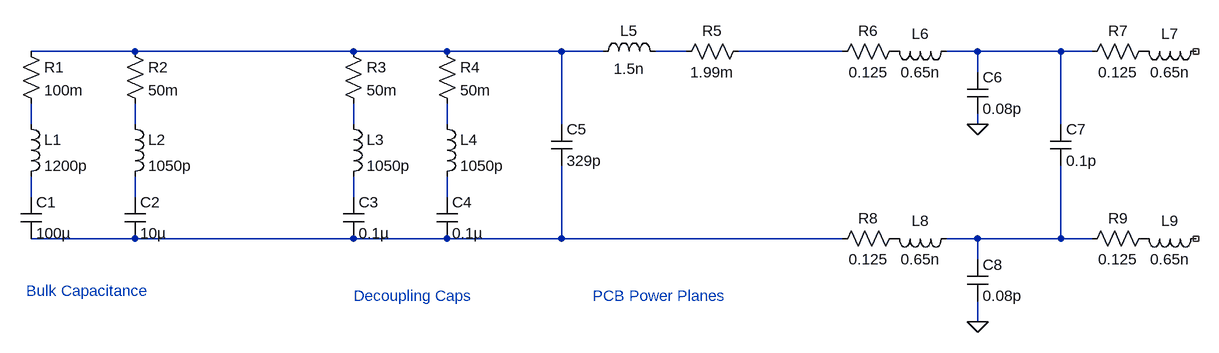
[diagram p0: schematic Draft3.asc]
Draft3.asc, the LTspice schematic file:
Version 4.1
SHEET 1 1864 680
WIRE 224 16 64 16
WIRE 560 16 224 16
WIRE 704 16 560 16
WIRE 880 16 704 16
WIRE 944 16 880 16
WIRE 1072 16 1024 16
WIRE 1312 16 1152 16
WIRE 1520 16 1472 16
WIRE 1648 16 1520 16
WIRE 1696 16 1648 16
WIRE 1520 48 1520 16
WIRE 64 128 64 96
WIRE 224 128 224 96
WIRE 560 128 560 96
WIRE 704 128 704 96
WIRE 880 128 880 16
WIRE 1520 128 1520 112
WIRE 1648 128 1648 16
WIRE 64 240 64 208
WIRE 224 240 224 208
WIRE 560 240 560 208
WIRE 704 240 704 208
WIRE 224 304 64 304
WIRE 560 304 224 304
WIRE 704 304 560 304
WIRE 880 304 880 192
WIRE 880 304 704 304
WIRE 1312 304 880 304
WIRE 1520 304 1472 304
WIRE 1648 304 1648 192
WIRE 1648 304 1520 304
WIRE 1696 304 1648 304
WIRE 1520 336 1520 304
WIRE 1520 432 1520 400
FLAG 1520 128 0
FLAG 1520 432 0
SYMBOL res 48 0 R0
SYMATTR InstName R1
SYMATTR Value 100m
SYMBOL ind 48 112 R0
SYMATTR InstName L1
SYMATTR Value 1200p
SYMBOL cap 48 240 R0
SYMATTR InstName C1
SYMATTR Value 100µ
SYMBOL res 208 0 R0
SYMATTR InstName R2
SYMATTR Value 50m
SYMBOL ind 208 112 R0
SYMATTR InstName L2
SYMATTR Value 1050p
SYMBOL cap 208 240 R0
SYMATTR InstName C2
SYMATTR Value 10µ
SYMBOL res 544 0 R0
SYMATTR InstName R3
SYMATTR Value 50m
SYMBOL ind 544 112 R0
SYMATTR InstName L3
SYMATTR Value 1050p
SYMBOL cap 544 240 R0
SYMATTR InstName C3
SYMATTR Value 0.1µ
SYMBOL res 688 0 R0
SYMATTR InstName R4
SYMATTR Value 50m
SYMBOL ind 688 112 R0
SYMATTR InstName L4
SYMATTR Value 1050p
SYMBOL cap 688 240 R0
SYMATTR InstName C4
SYMATTR Value 0.1µ
SYMBOL cap 864 128 R0
SYMATTR InstName C5
SYMATTR Value 329p
SYMBOL ind 928 32 R270
WINDOW 0 32 56 VTop 2
WINDOW 3 5 56 VBottom 2
SYMATTR InstName L5
SYMATTR Value 1.5n
SYMBOL res 1168 0 R90
WINDOW 0 0 56 VBottom 2
WINDOW 3 32 56 VTop 2
SYMATTR InstName R5
SYMATTR Value 1.99m
SYMBOL res 1408 0 R90
WINDOW 0 0 56 VBottom 2
WINDOW 3 32 56 VTop 2
SYMATTR InstName R6
SYMATTR Value 0.125
SYMBOL ind 1488 0 R90
WINDOW 0 4 56 VBottom 2
WINDOW 3 32 56 VTop 2
SYMATTR InstName L6
SYMATTR Value 0.65n
SYMATTR Type ind
SYMBOL res 1792 0 R90
WINDOW 0 0 56 VBottom 2
WINDOW 3 32 56 VTop 2
SYMATTR InstName R7
SYMATTR Value 0.125
SYMBOL ind 1872 0 R90
WINDOW 0 4 56 VBottom 2
WINDOW 3 32 56 VTop 2
SYMATTR InstName L7
SYMATTR Value 0.65n
SYMATTR Type ind
SYMBOL cap 1504 48 R0
SYMATTR InstName C6
SYMATTR Value 0.08p
SYMBOL cap 1632 128 R0
SYMATTR InstName C7
SYMATTR Value 0.1p
SYMBOL res 1408 288 R90
WINDOW 0 0 56 VBottom 2
WINDOW 3 32 56 VTop 2
SYMATTR InstName R8
SYMATTR Value 0.125
SYMBOL ind 1488 288 R90
WINDOW 0 4 56 VBottom 2
WINDOW 3 32 56 VTop 2
SYMATTR InstName L8
SYMATTR Value 0.65n
SYMATTR Type ind
SYMBOL res 1792 288 R90
WINDOW 0 0 56 VBottom 2
WINDOW 3 32 56 VTop 2
SYMATTR InstName R9
SYMATTR Value 0.125
SYMBOL ind 1872 288 R90
WINDOW 0 4 56 VBottom 2
WINDOW 3 32 56 VTop 2
SYMATTR InstName L9
SYMATTR Value 0.65n
SYMATTR Type ind
SYMBOL cap 1504 336 R0
SYMATTR InstName C8
SYMATTR Value 0.08p
TEXT 56 384 Left 2 ;Bulk Capacitance
TEXT 560 392 Left 2 ;Decoupling Caps
TEXT 928 392 Left 2 ;PCB Power Planes

The netlist it stands for:
* Draft3.asc
R1 N001 N005 100m
L1 N005 N009 1200p
C1 N009 N013 100µ
R2 N001 N006 50m
L2 N006 N010 1050p
C2 N010 N013 10µ
R3 N001 N007 50m
L3 N007 N011 1050p
C3 N011 N013 0.1µ
R4 N001 N008 50m
L4 N008 N012 1050p
C4 N012 N013 0.1µ
C5 N001 N013 329p
L5 N001 N002 1.5n
R5 N003 N002 1.99m
R6 P001 N003 0.125
L6 N004 P001 0.65n
R7 P002 N004 0.125
L7 NC_01 P002 0.65n
C6 N004 0 0.08p
C7 N004 N014 0.1p
R8 P003 N013 0.125
L8 N014 P003 0.65n
R9 P004 N014 0.125
L9 NC_02 P004 0.65n
C8 N014 0 0.08p
* Bulk Capacitance
* Decoupling Caps
* PCB Power Planes
.backanno
.end